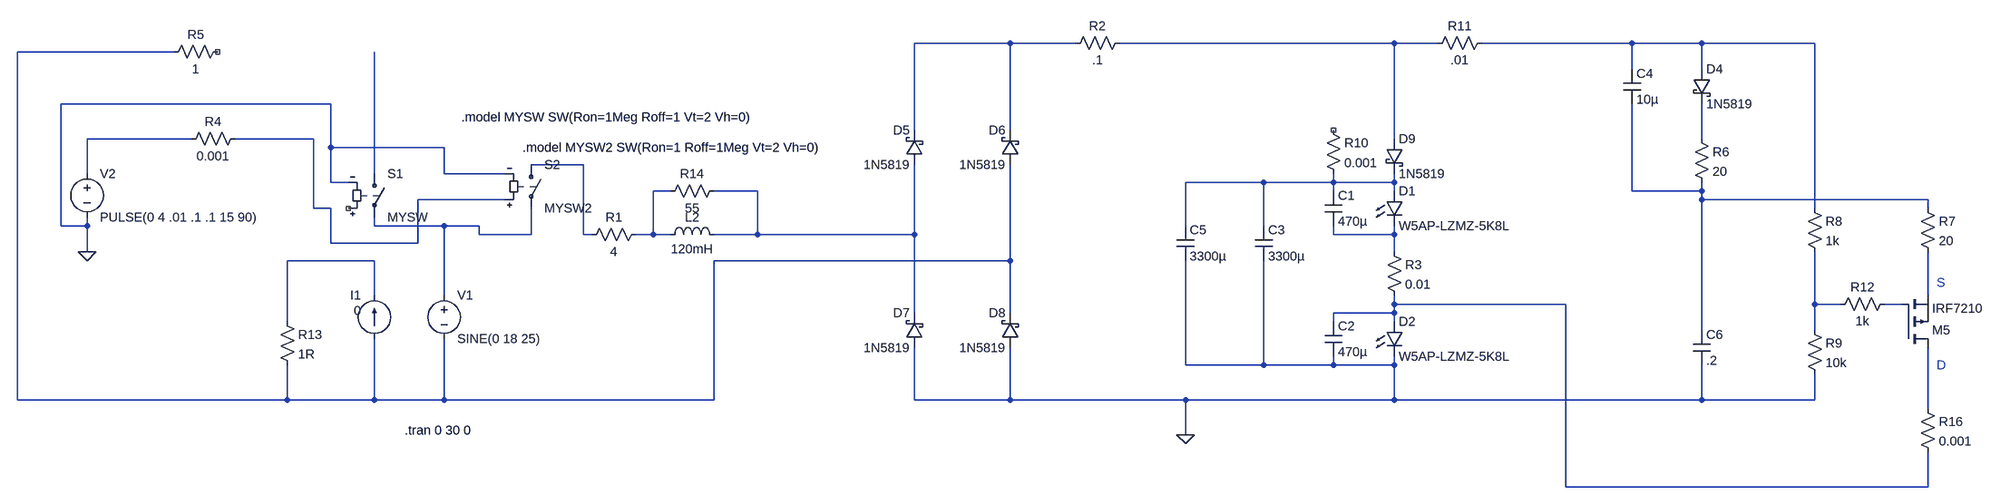
[diagram p0: schematic Dyn stand light w P FeT V2.asc]
Dyn stand light w P FeT V2.asc, the LTspice schematic file:
Version 4
SHEET 1 3312 808
WIRE 640 -176 464 -176
WIRE 1056 -176 640 -176
WIRE 1648 -176 1136 -176
WIRE 1728 -176 1648 -176
WIRE 2448 -176 1808 -176
WIRE 2576 -176 2448 -176
WIRE 2992 -176 2576 -176
WIRE -896 -160 -1184 -160
WIRE 2448 -128 2448 -176
WIRE 2576 -128 2576 -176
WIRE -608 -64 -1104 -64
WIRE 464 -16 464 -176
WIRE 640 -16 640 -176
WIRE -864 0 -1056 0
WIRE -640 0 -784 0
WIRE 1648 0 1648 -176
WIRE 2576 0 2576 -64
WIRE -608 16 -608 -64
WIRE -400 16 -608 16
WIRE -144 48 -240 48
WIRE -1056 64 -1056 0
WIRE -528 64 -528 -160
WIRE -400 64 -400 16
WIRE -288 64 -400 64
WIRE -608 80 -608 16
WIRE -576 80 -608 80
WIRE 1408 80 1264 80
WIRE 1536 80 1536 64
WIRE 1536 80 1408 80
WIRE 1648 80 1648 64
WIRE 1648 80 1536 80
WIRE 16 96 -16 96
WIRE 176 96 96 96
WIRE 1536 96 1536 80
WIRE 1648 96 1648 80
WIRE 2448 96 2448 -64
WIRE 2576 96 2576 80
WIRE 2576 96 2448 96
WIRE -288 112 -448 112
WIRE 2576 112 2576 96
WIRE 3200 112 2576 112
WIRE -640 128 -640 0
WIRE -608 128 -640 128
WIRE 2992 128 2992 -176
WIRE 3200 128 3200 112
WIRE -1104 160 -1104 -64
WIRE -1056 160 -1056 144
WIRE -1056 160 -1104 160
WIRE -528 160 -528 144
WIRE -400 160 -528 160
WIRE -336 160 -400 160
WIRE 1264 160 1264 80
WIRE 1408 160 1408 80
WIRE -336 176 -336 160
WIRE -240 176 -240 128
WIRE -240 176 -336 176
WIRE -144 176 -144 48
WIRE -128 176 -144 176
WIRE -16 176 -16 96
WIRE -16 176 -48 176
WIRE 16 176 -16 176
WIRE 176 176 176 96
WIRE 176 176 96 176
WIRE 464 176 464 48
WIRE 464 176 176 176
WIRE 1536 176 1536 160
WIRE 1648 176 1648 160
WIRE 1648 176 1536 176
WIRE -608 192 -608 128
WIRE -448 192 -448 112
WIRE -448 192 -608 192
WIRE -1056 208 -1056 160
WIRE 1648 208 1648 176
WIRE -528 224 -688 224
WIRE 640 224 640 48
WIRE 640 224 96 224
WIRE -528 288 -528 224
WIRE -400 288 -400 160
WIRE 3200 288 3200 208
WIRE 1648 304 1648 288
WIRE 1984 304 1648 304
WIRE 2992 304 2992 208
WIRE 3040 304 2992 304
WIRE 3152 304 3120 304
WIRE 464 320 464 176
WIRE 640 320 640 224
WIRE 1648 320 1648 304
WIRE 1648 320 1536 320
WIRE -688 336 -688 224
WIRE 1536 336 1536 320
WIRE 1648 336 1648 320
WIRE 2576 352 2576 112
WIRE 2992 352 2992 304
WIRE 1264 416 1264 224
WIRE 1408 416 1408 224
WIRE 1408 416 1264 416
WIRE 1536 416 1536 400
WIRE 1536 416 1408 416
WIRE 1648 416 1648 400
WIRE 1648 416 1536 416
WIRE -1184 480 -1184 -160
WIRE -688 480 -688 416
WIRE -688 480 -1184 480
WIRE -528 480 -528 368
WIRE -528 480 -688 480
WIRE -400 480 -400 368
WIRE -400 480 -528 480
WIRE 96 480 96 224
WIRE 96 480 -400 480
WIRE 464 480 464 384
WIRE 640 480 640 384
WIRE 640 480 464 480
WIRE 1264 480 640 480
WIRE 1648 480 1648 416
WIRE 1648 480 1264 480
WIRE 2576 480 2576 416
WIRE 2576 480 1648 480
WIRE 2992 480 2992 432
WIRE 2992 480 2576 480
WIRE 3200 496 3200 384
WIRE 1264 544 1264 480
WIRE 1984 640 1984 304
WIRE 3200 640 3200 576
WIRE 3200 640 1984 640
FLAG 1264 544 0
FLAG -1056 208 0
SYMBOL res -144 192 R270
WINDOW 0 32 56 VTop 2
WINDOW 3 0 56 VBottom 2
SYMATTR InstName R1
SYMATTR Value 4
SYMBOL schottky 480 48 R180
WINDOW 0 24 64 Left 2
WINDOW 3 24 0 Left 2
SYMATTR InstName D5
SYMATTR Value 1N5819
SYMATTR Description Diode
SYMATTR Type diode
SYMBOL schottky 656 48 R180
WINDOW 0 24 64 Left 2
WINDOW 3 24 0 Left 2
SYMATTR InstName D6
SYMATTR Value 1N5819
SYMATTR Description Diode
SYMATTR Type diode
SYMBOL schottky 480 384 R180
WINDOW 0 24 64 Left 2
WINDOW 3 24 0 Left 2
SYMATTR InstName D7
SYMATTR Value 1N5819
SYMATTR Description Diode
SYMATTR Type diode
SYMBOL schottky 656 384 R180
WINDOW 0 24 64 Left 2
WINDOW 3 24 0 Left 2
SYMATTR InstName D8
SYMATTR Value 1N5819
SYMATTR Description Diode
SYMATTR Type diode
SYMBOL LED 1632 96 R0
SYMATTR InstName D1
SYMATTR Value W5AP-LZMZ-5K8L
SYMATTR Description Diode
SYMATTR Type diode
SYMBOL LED 1632 336 R0
SYMATTR InstName D2
SYMATTR Value W5AP-LZMZ-5K8L
SYMATTR Description Diode
SYMATTR Type diode
SYMBOL cap 1520 96 R0
SYMATTR InstName C1
SYMATTR Value 470µ
SYMATTR SpiceLine V=16
SYMBOL cap 1520 336 R0
SYMATTR InstName C2
SYMATTR Value 470µ
SYMATTR SpiceLine V=16
SYMBOL cap 1392 160 R0
SYMATTR InstName C3
SYMATTR Value 3300µ
SYMATTR SpiceLine V=35
SYMBOL ind 0 192 R270
WINDOW 0 32 56 VTop 2
WINDOW 3 5 56 VBottom 2
SYMATTR InstName L2
SYMATTR Value 120mH
SYMBOL current -528 368 R180
WINDOW 0 24 80 Left 2
WINDOW 3 24 52 Left 2
WINDOW 123 0 0 Left 0
WINDOW 39 0 0 Left 0
SYMATTR InstName I1
SYMATTR Value 0
SYMBOL res 1040 -160 R270
WINDOW 0 32 56 VTop 2
WINDOW 3 0 56 VBottom 2
SYMATTR InstName R2
SYMATTR Value .1
SYMBOL res 1632 192 R0
SYMATTR InstName R3
SYMATTR Value 0.01
SYMBOL sw -528 48 R0
SYMATTR InstName S1
SYMATTR Value MYSW
SYMBOL voltage -1056 48 R0
WINDOW 123 0 0 Left 0
WINDOW 39 0 0 Left 0
SYMATTR InstName V2
SYMATTR Value PULSE(0 4 .01 .1 .1 15 90)
SYMBOL res -768 -16 R90
WINDOW 0 0 56 VBottom 2
WINDOW 3 32 56 VTop 2
SYMATTR InstName R4
SYMATTR Value 0.001
SYMBOL res -800 -176 R90
WINDOW 0 0 56 VBottom 2
WINDOW 3 32 56 VTop 2
SYMATTR InstName R5
SYMATTR Value 1
SYMBOL cap 2560 352 R0
SYMATTR InstName C6
SYMATTR Value .2
SYMATTR SpiceLine V=5.5
SYMBOL pmos 3152 384 M180
SYMATTR InstName M5
SYMATTR Value IRF7210
SYMBOL res 2560 -16 R0
SYMATTR InstName R6
SYMATTR Value 20
SYMBOL schottky 2560 -128 R0
SYMATTR InstName D4
SYMATTR Value 1N5819
SYMATTR Description Diode
SYMATTR Type diode
SYMBOL res 3184 112 R0
SYMATTR InstName R7
SYMATTR Value 20
SYMBOL res 2976 112 R0
SYMATTR InstName R8
SYMATTR Value 1k
SYMBOL res 2976 336 R0
SYMATTR InstName R9
SYMATTR Value 10k
SYMBOL res 1712 -160 R270
WINDOW 0 32 56 VTop 2
WINDOW 3 0 56 VBottom 2
SYMATTR InstName R11
SYMATTR Value .01
SYMBOL schottky 1632 0 R0
SYMATTR InstName D9
SYMATTR Value 1N5819
SYMATTR Description Diode
SYMATTR Type diode
SYMBOL res 3024 320 R270
WINDOW 0 32 56 VTop 2
WINDOW 3 0 56 VBottom 2
SYMATTR InstName R12
SYMATTR Value 1k
SYMBOL voltage -400 272 R0
WINDOW 123 0 0 Left 0
WINDOW 39 0 0 Left 0
SYMATTR InstName V1
SYMATTR Value SINE(0 18 25)
SYMBOL res -704 320 R0
SYMATTR InstName R13
SYMATTR Value 1R
SYMBOL sw -240 32 R0
SYMATTR InstName S2
SYMATTR Value MYSW2
SYMBOL res 0 112 R270
WINDOW 0 32 56 VTop 2
WINDOW 3 0 56 VBottom 2
SYMATTR InstName R14
SYMATTR Value 55
SYMBOL cap 2432 -128 R0
SYMATTR InstName C4
SYMATTR Value 10µ
SYMATTR SpiceLine V=35
SYMBOL res 3184 480 R0
SYMATTR InstName R16
SYMATTR Value 0.001
SYMBOL res 1520 -32 R0
SYMATTR InstName R10
SYMATTR Value 0.001
SYMBOL cap 1248 160 R0
SYMATTR InstName C5
SYMATTR Value 3300µ
SYMATTR SpiceLine V=35
TEXT -472 536 Left 2 !.tran 0 30 0
TEXT -368 -40 Left 2 !.model MYSW SW(Ron=1Meg Roff=1 Vt=2 Vh=0)
TEXT 3216 416 Left 2 ;D
TEXT 3216 264 Left 2 ;S
TEXT -256 16 Left 2 !.model MYSW2 SW(Ron=1 Roff=1Meg Vt=2 Vh=0)

The netlist it stands for:
* Dyn stand light w P FeT V2.asc
R1 N008 N011 4
D5 N012 N001 1N5819
D6 N004 N001 1N5819
D7 0 N012 1N5819
D8 0 N004 1N5819
D1 N010 N015 W5AP-LZMZ-5K8L
D2 N018 0 W5AP-LZMZ-5K8L
C1 N010 N015 470µ V=16
C2 N018 0 470µ V=16
C3 N010 0 3300µ V=35
L2 N011 N012 120mH
I1 N004 N016 0
R2 N001 N002 .1
R3 N015 N018 0.01
S1 N009 N014 NC_01 0 MYSW
V2 N005 0 PULSE(0 4 .01 .1 .1 15 90)
R4 N006 N005 0.001
R5 NC_02 N004 1
C6 N013 0 .2 V=5.5
M5 N021 N020 N017 N017 IRF7210
R6 N007 N013 20
D4 N003 N007 1N5819
R7 N013 N017 20
R8 N003 N019 1k
R9 N019 0 10k
R11 N002 N003 .01
D9 N002 N010 1N5819
R12 N019 N020 1k
V1 N014 N004 SINE(0 18 25)
R13 N016 N004 1R
S2 N008 N014 N006 0 MYSW2
R14 N011 N012 55
C4 N003 N013 10µ V=35
R16 N021 N018 0.001
R10 NC_03 N010 0.001
C5 N010 0 3300µ V=35
.model D D
.lib standard.dio
.model NMOS NMOS
.model PMOS PMOS
.lib standard.mos
.tran 0 30 0
.model MYSW SW(Ron=1Meg Roff=1 Vt=2 Vh=0)
* D
* S
.model MYSW2 SW(Ron=1 Roff=1Meg Vt=2 Vh=0)
.backanno
.end